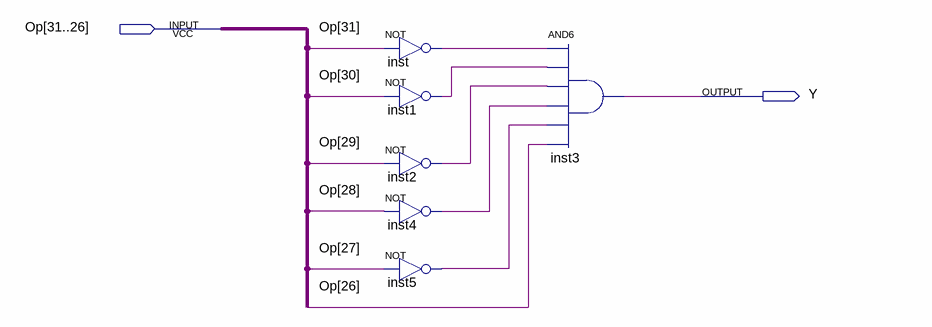
[diagram p0: schematic sheet]
// Quartus schematic BGEZ.bdf as structural Verilog: 6 symbols, 2 pins
module BGEZ (
  input  [31:26] Op,
  output Y
);

  wire inst1_out, inst2_out, inst4_out, inst5_out, inst_out;

  not inst (inst_out, Op[31]);
  not inst1 (inst1_out, Op[30]);
  not inst2 (inst2_out, Op[29]);
  not inst4 (inst4_out, Op[28]);
  not inst5 (inst5_out, Op[27]);
  and inst3 (Y, inst_out, inst1_out, inst2_out, inst4_out, inst5_out, Op[26]);
endmodule
